# Altium schematic sheet Ethernet.SchDoc: {Наименование}
size 420 x 297 mm; DocumentNumber: ПЛАС.ХХХХХХ.ХХХ ХХ; SheetNumber: 4; SheetTotal: 11; PageSetup: Record=PageOptions|CenterHorizontal=False|CenterVertical=False|PrintScale=0.95|XCorrection=0.00|YCorrection=0.00|PrintKind=1|BorderSize=5000000|LeftOffset=0|BottomOffset=0|Orientation=1|PaperLength=1000|PaperWidth=1000|Scale=100|PaperSource=15|PrintQuality=600|MediaType=1|DitherType=10|PaperKind=A4|PrintScaleMode=1; Rule: PcbType=ProtelPcb
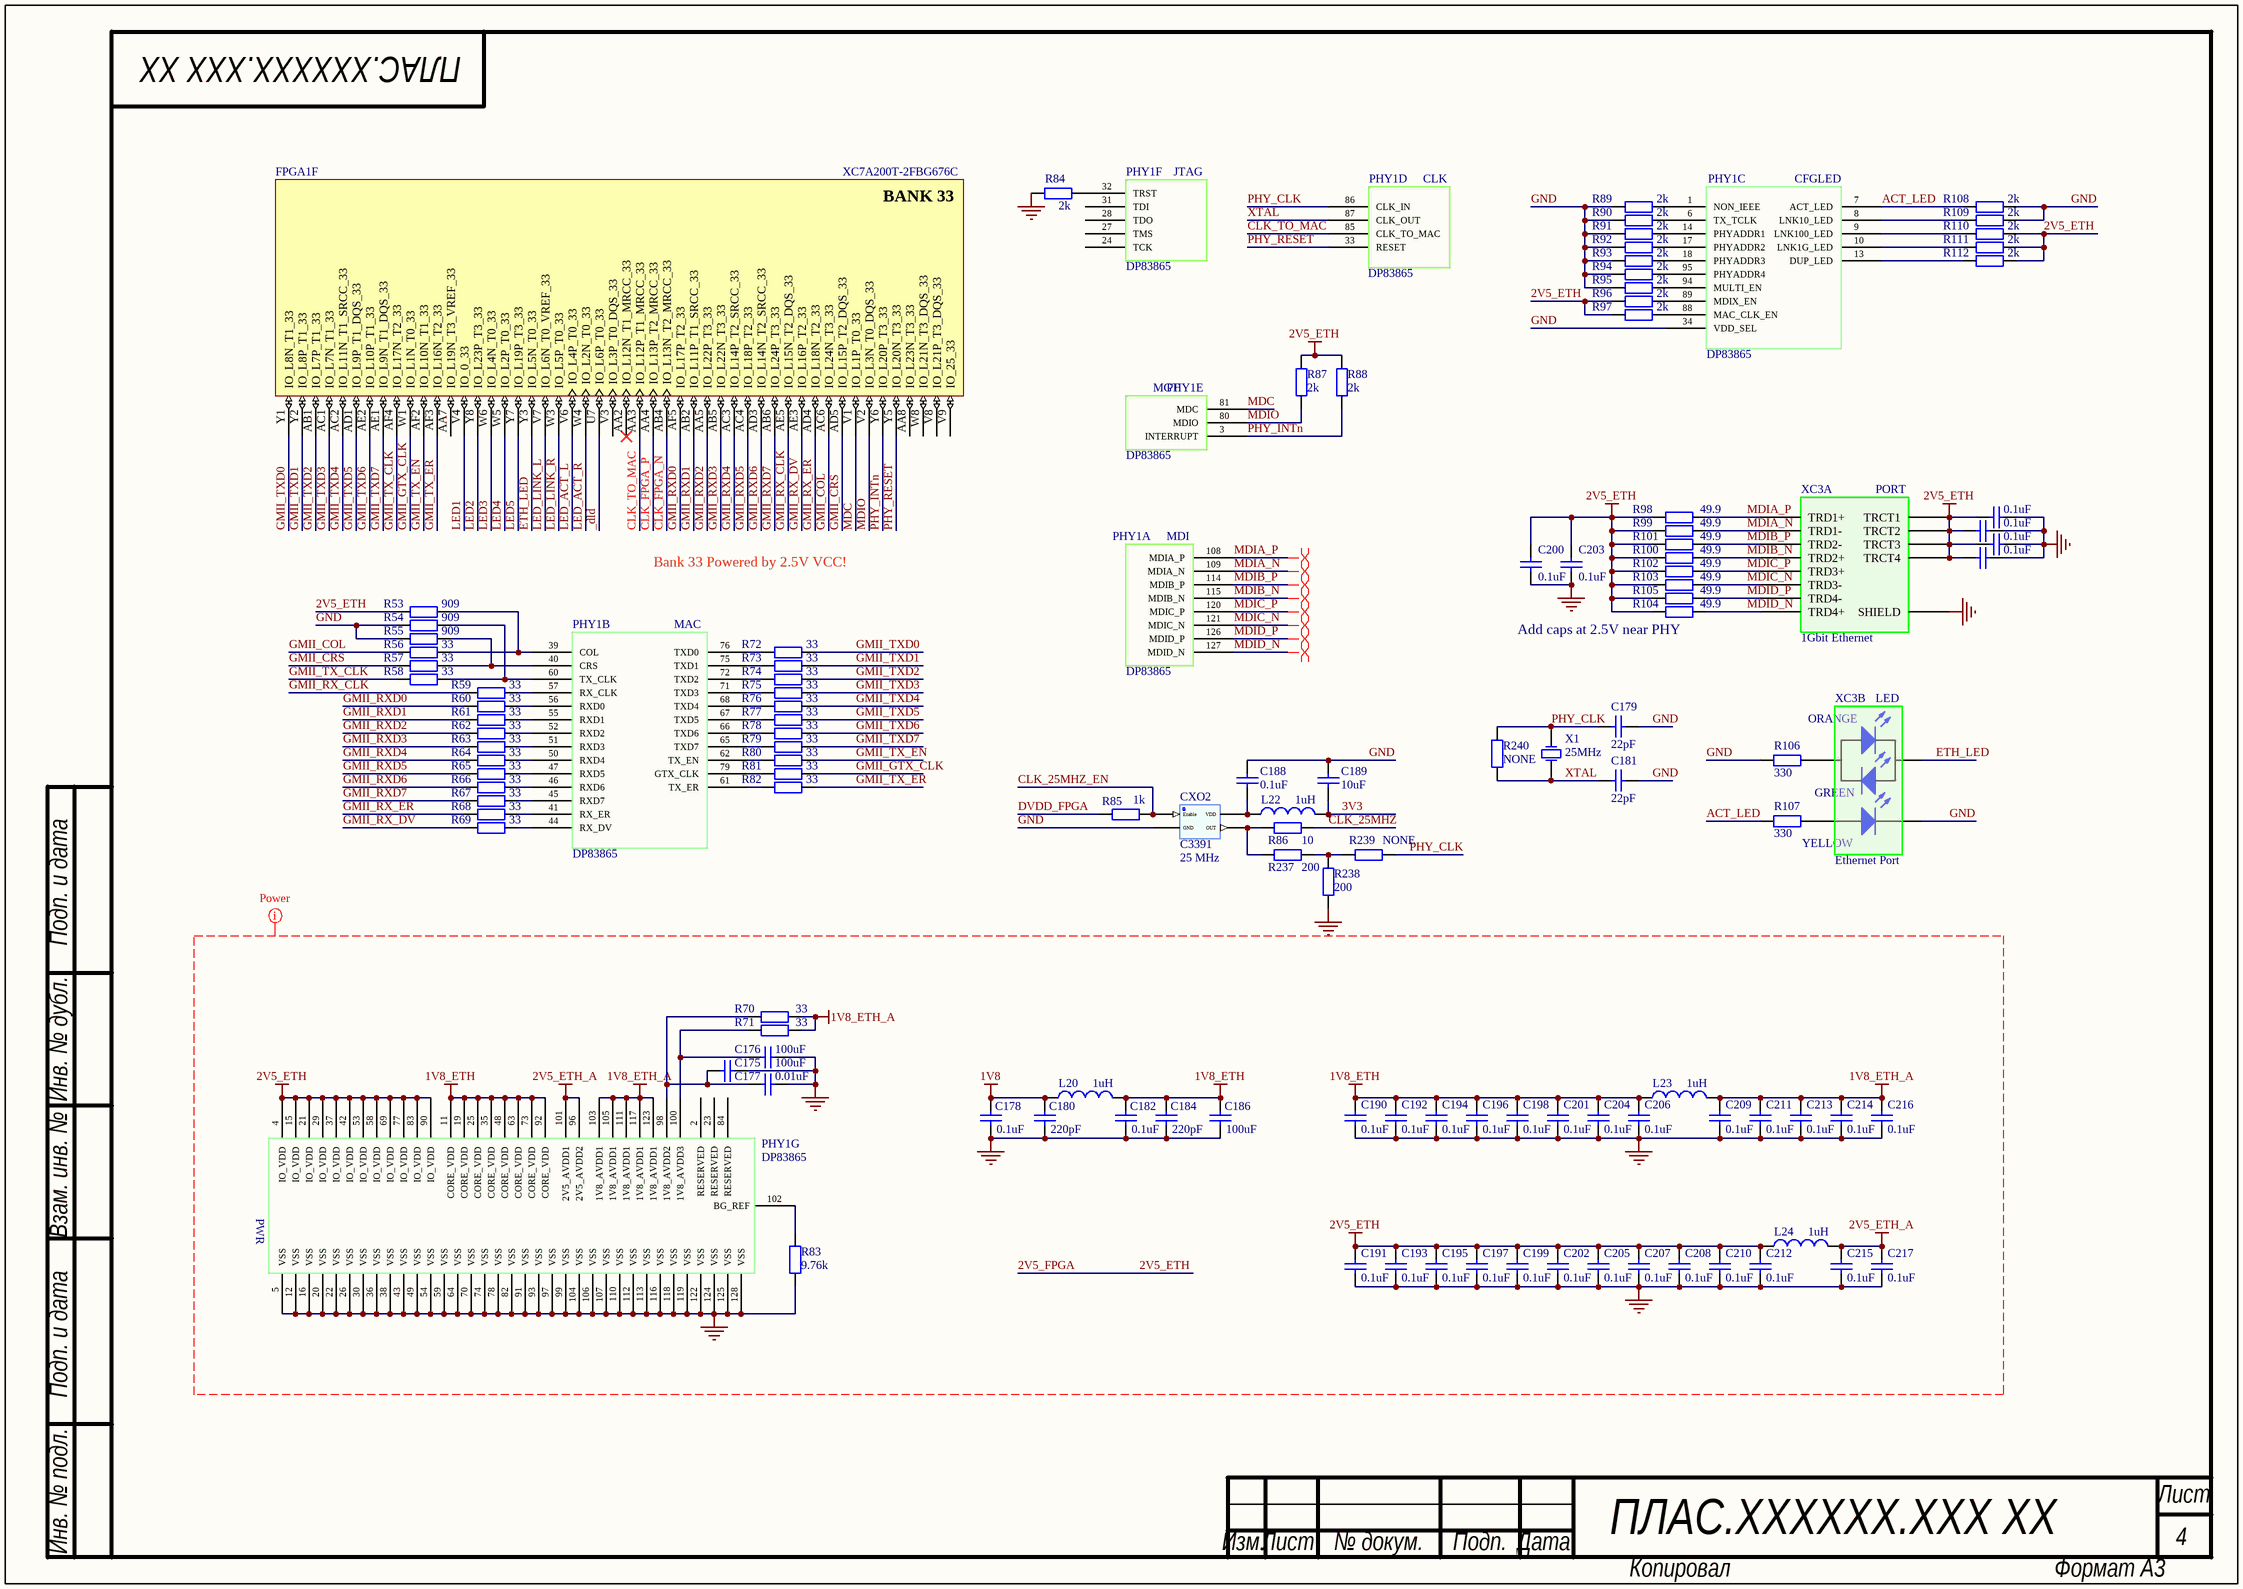
[diagram p0: Ethernet.SchDoc]

## Parts
C175  value 100uF  [C1210]  (hidden comment: Cap)
C176  value 100uF  [C1210]  (hidden comment: Cap)
C177  value 0.01uF  [C0603]  (hidden comment: Cap)
C178  value 0.1uF  [C0603]  (hidden comment: Cap)
C179  value 22pF  [С0402]  (hidden comment: Cap)
C180  value 220pF  [C0603]  (hidden comment: Cap)
C181  value 22pF  [С0402]  (hidden comment: Cap)
C182  value 0.1uF  [C0603]  (hidden comment: Cap)
C184  value 220pF  [C0603]  (hidden comment: Cap)
C186  value 100uF  [C1210]  (hidden comment: Cap)
C188  value 0.1uF  [C0603]  (hidden comment: Cap)
C189  value 10uF  [C0603]  (hidden comment: Cap)
C190  value 0.1uF  [C0603]  (hidden comment: Cap)
C191  value 0.1uF  [C0603]  (hidden comment: Cap)
C192  value 0.1uF  [C0603]  (hidden comment: Cap)
C193  value 0.1uF  [C0603]  (hidden comment: Cap)
C194  value 0.1uF  [C0603]  (hidden comment: Cap)
C195  value 0.1uF  [C0603]  (hidden comment: Cap)
C196  value 0.1uF  [C0603]  (hidden comment: Cap)
C197  value 0.1uF  [C0603]  (hidden comment: Cap)
C198  value 0.1uF  [C0603]  (hidden comment: Cap)
C199  value 0.1uF  [C0603]  (hidden comment: Cap)
C200  value 0.1uF  [С0402]  (hidden comment: Cap)
C201  value 0.1uF  [C0603]  (hidden comment: Cap)
C202  value 0.1uF  [C0603]  (hidden comment: Cap)
C203  value 0.1uF  [С0402]  (hidden comment: Cap)
C204  value 0.1uF  [C0603]  (hidden comment: Cap)
C205  value 0.1uF  [C0603]  (hidden comment: Cap)
C206  value 0.1uF  [C0603]  (hidden comment: Cap)
C207  value 0.1uF  [C0603]  (hidden comment: Cap)
C208  value 0.1uF  [C0603]  (hidden comment: Cap)
C209  value 0.1uF  [C0603]  (hidden comment: Cap)
C210  value 0.1uF  [C0603]  (hidden comment: Cap)
C211  value 0.1uF  [C0603]  (hidden comment: Cap)
C212  value 0.1uF  [C0603]  (hidden comment: Cap)
C213  value 0.1uF  [C0603]  (hidden comment: Cap)
C214  value 0.1uF  [C0603]  (hidden comment: Cap)
C215  value 0.1uF  [C0603]  (hidden comment: Cap)
C216  value 0.1uF  [C0603]  (hidden comment: Cap)
C217  value 0.1uF  [C0603]  (hidden comment: Cap)
C218  value 0.1uF  [С0402]  (hidden comment: Cap)
C219  value 0.1uF  [С0402]  (hidden comment: Cap)
C220  value 0.1uF  [С0402]  (hidden comment: Cap)
C221  value 0.1uF  [С0402]  (hidden comment: Cap)
CXO2  C3391  Frequency: 25 MHz  [CTS_CB3]
FPGA1  XC7A200T-2FBG676C  [FGG676]  (part F of 14)
L20  value 1uH  [L1210_Murata LQH]  (hidden comment: Inductor_LF)
L22  value 1uH  [L1206_Murata]  (hidden comment: Inductor_LF)
L23  value 1uH  [L1210_Murata LQH]  (hidden comment: Inductor_LF)
L24  value 1uH  [L1210_Murata LQH]  (hidden comment: Inductor_LF)
PHY1  DP83865  [LQFP-128]  (parts A,B,C,D,E,F,G of 7)
R53  value 909  [R0402]  (hidden comment: Res)
R54  value 909  [R0402]  (hidden comment: Res)
R55  value 909  [R0402]  (hidden comment: Res)
R56  value 33  [R0402]  (hidden comment: Res)
R57  value 33  [R0402]  (hidden comment: Res)
R58  value 33  [R0402]  (hidden comment: Res)
R59  value 33  [R0402]  (hidden comment: Res)
R60  value 33  [R0402]  (hidden comment: Res)
R61  value 33  [R0402]  (hidden comment: Res)
R62  value 33  [R0402]  (hidden comment: Res)
R63  value 33  [R0402]  (hidden comment: Res)
R64  value 33  [R0402]  (hidden comment: Res)
R65  value 33  [R0402]  (hidden comment: Res)
R66  value 33  [R0402]  (hidden comment: Res)
R67  value 33  [R0402]  (hidden comment: Res)
R68  value 33  [R0402]  (hidden comment: Res)
R69  value 33  [R0402]  (hidden comment: Res)
R70  value 33  [R0402]  (hidden comment: Res)
R71  value 33  [R0402]  (hidden comment: Res)
R72  value 33  [R0402]  (hidden comment: Res)
R73  value 33  [R0402]  (hidden comment: Res)
R74  value 33  [R0402]  (hidden comment: Res)
R75  value 33  [R0402]  (hidden comment: Res)
R76  value 33  [R0402]  (hidden comment: Res)
R77  value 33  [R0402]  (hidden comment: Res)
R78  value 33  [R0402]  (hidden comment: Res)
R79  value 33  [R0402]  (hidden comment: Res)
R80  value 33  [R0402]  (hidden comment: Res)
R81  value 33  [R0402]  (hidden comment: Res)
R82  value 33  [R0402]  (hidden comment: Res)
R83  value 9.76k  [R0402]  (hidden comment: Res)
R84  value 2k  [R0402]  (hidden comment: Res)
R85  value 1k  [R0402]  (hidden comment: Res)
R86  value 10  [R0402]  (hidden comment: Res)
R87  value 2k  [R0402]  (hidden comment: Res)
R88  value 2k  [R0402]  (hidden comment: Res)
R89  value 2k  [R0402]  (hidden comment: Res)
R90  value 2k  [R0402]  (hidden comment: Res)
R91  value 2k  [R0402]  (hidden comment: Res)
R92  value 2k  [R0402]  (hidden comment: Res)
R93  value 2k  [R0402]  (hidden comment: Res)
R94  value 2k  [R0402]  (hidden comment: Res)
R95  value 2k  [R0402]  (hidden comment: Res)
R96  value 2k  [R0402]  (hidden comment: Res)
R97  value 2k  [R0402]  (hidden comment: Res)
R98  value 49.9  [R0402]  (hidden comment: Res)
R99  value 49.9  [R0402]  (hidden comment: Res)
R100  value 49.9  [R0402]  (hidden comment: Res)
R101  value 49.9  [R0402]  (hidden comment: Res)
R102  value 49.9  [R0402]  (hidden comment: Res)
R103  value 49.9  [R0402]  (hidden comment: Res)
R104  value 49.9  [R0402]  (hidden comment: Res)
R105  value 49.9  [R0402]  (hidden comment: Res)
R106  value 330  [R0402]  (hidden comment: Res)
R107  value 330  [R0402]  (hidden comment: Res)
R108  value 2k  [R0402]  (hidden comment: Res)
R109  value 2k  [R0402]  (hidden comment: Res)
R110  value 2k  [R0402]  (hidden comment: Res)
R111  value 2k  [R0402]  (hidden comment: Res)
R112  value 2k  [R0402]  (hidden comment: Res)
R237  value 200  [R0402]  (hidden comment: Res)
R238  value 200  [R0402]  (hidden comment: Res)
R239  value NONE  [R0402]  (hidden comment: Res)
R240  value NONE  [R0402]  (hidden comment: Res)
X1  25MHz  [XTAL]
XC3  1Gbit Ethernet  [0826-1X1T-23-F]  (parts A,B of 2)

## Nets
1V8: C178.1 C180.1 L20.2
1V8_ETH: C182.1 C184.1 C186.1 C190.2 C192.1 C194.1 C196.2 C198.1 C201.1 C204.1 C206.1 L20.1 L23.1 PHY1.11(CORE_VDD) PHY1.19(CORE_VDD) PHY1.25(CORE_VDD) PHY1.35(CORE_VDD) PHY1.48(CORE_VDD) PHY1.63(CORE_VDD) PHY1.73(CORE_VDD) PHY1.92(CORE_VDD)
1V8_ETH_A: C209.1 C211.1 C213.1 C214.1 C216.1 L23.2 PHY1.103(1V8_AVDD1) PHY1.105(1V8_AVDD1) PHY1.111(1V8_AVDD1) PHY1.117(1V8_AVDD1) PHY1.123(1V8_AVDD1) R70.1 R71.1
2V5_ETH: C191.1 C193.1 C195.1 C197.1 C199.2 C200.1 C202.2 C203.1 C205.1 C207.1 C208.1 C210.1 C212.1 C218.1 C219.1 C220.1 C221.1 L24.1 PHY1.4(IO_VDD) PHY1.15(IO_VDD) PHY1.21(IO_VDD) PHY1.29(IO_VDD) PHY1.37(IO_VDD) PHY1.42(IO_VDD) PHY1.53(IO_VDD) PHY1.58(IO_VDD) PHY1.69(IO_VDD) PHY1.77(IO_VDD) PHY1.83(IO_VDD) PHY1.90(IO_VDD) R53.1 R87.1 R88.1 R96.1 R97.1 R98.1 R99.1 R100.1 R101.1 R102.1 R103.1 R104.1 R105.1 R110.2 R111.2 R112.2 XC3.1(TRCT3) XC3.6(TRCT2) XC3.7(TRCT4) XC3.12(TRCT1)  [also labelled 2V5_FPGA]
2V5_ETH_A: C215.1 C217.1 L24.2 PHY1.96(2V5_AVDD2) PHY1.101(2V5_AVDD1)
GND: C175.1 C176.1 C177.1 C178.2 C179.2 C180.2 C181.2 C182.2 C184.2 C186.2 C188.2 C189.1 C190.1 C191.2 C192.2 C193.2 C194.2 C195.2 C196.1 C197.2 C198.2 C199.1 C200.2 C201.2 C202.1 C203.2 C204.2 C205.2 C206.2 C207.2 C208.2 C209.2 C210.2 C211.2 C212.2 C213.2 C214.2 C215.2 C216.2 C217.2 C218.2 C219.2 C220.2 C221.2 CXO2.2(GND) PHY1.5(VSS) PHY1.12(VSS) PHY1.16(VSS) PHY1.20(VSS) PHY1.22(VSS) PHY1.26(VSS) PHY1.30(VSS) PHY1.34(VDD_SEL) PHY1.36(VSS) PHY1.38(VSS) PHY1.43(VSS) PHY1.49(VSS) PHY1.54(VSS) PHY1.59(VSS) PHY1.64(VSS) PHY1.70(VSS) PHY1.74(VSS) PHY1.78(VSS) PHY1.82(VSS) PHY1.91(VSS) PHY1.93(VSS) PHY1.97(VSS) PHY1.99(VSS) PHY1.104(VSS) PHY1.106(VSS) PHY1.107(VSS) PHY1.110(VSS) PHY1.112(VSS) PHY1.113(VSS) PHY1.116(VSS) PHY1.118(VSS) PHY1.119(VSS) PHY1.122(VSS) PHY1.124(VSS) PHY1.125(VSS) PHY1.128(VSS) R54.1 R55.2 R83.2 R84.2 R89.2 R90.2 R91.1 R92.2 R93.1 R94.1 R95.1 R106.2 R108.1 R109.1 R238.2 XC3.0(SHIELD) XC3.13(LED1)
3V3: C189.2 L22.1
_dld: FPGA1.U7(IO_L6P_T0_33)
ACT_LED: PHY1.7(ACT_LED) R107.1 R108.2
CLK_25MHZ: R86.1
CLK_25MHZ_EN: CXO2.1(Enable) R85.1
CLK_FPGA_N: FPGA1.AB4(IO_L13N_T2_MRCC_33)
CLK_FPGA_P: FPGA1.AA4(IO_L13P_T2_MRCC_33)
CLK_TO_MAC: FPGA1.AA3(IO_L12P_T1_MRCC_33) PHY1.85(CLK_TO_MAC)
DVDD_FPGA: R85.2
ETH_LED: FPGA1.Y3(IO_L5N_T0_33) XC3.16(LED2)
GMII_COL: FPGA1.AC6(IO_L24N_T3_33) R56.1
GMII_CRS: FPGA1.AD5(IO_L15P_T2_DQS_33) R57.1
GMII_GTX_CLK: FPGA1.W1(IO_L1N_T0_33) R81.2
GMII_RX_CLK: FPGA1.AE5(IO_L15N_T2_DQS_33) R59.2
GMII_RX_DV: FPGA1.AE3(IO_L16P_T2_33) R69.2
GMII_RX_ER: FPGA1.AD4(IO_L18N_T2_33) R68.2
GMII_RXD0: FPGA1.AF5(IO_L17P_T2_33) R60.2
GMII_RXD1: FPGA1.AB2(IO_L11P_T1_SRCC_33) R61.2
GMII_RXD2: FPGA1.AA5(IO_L22P_T3_33) R62.2
GMII_RXD3: FPGA1.AB5(IO_L22N_T3_33) R63.2
GMII_RXD4: FPGA1.AC3(IO_L14P_T2_SRCC_33) R64.2
GMII_RXD5: FPGA1.AC4(IO_L18P_T2_33) R65.2
GMII_RXD6: FPGA1.AD3(IO_L14N_T2_SRCC_33) R66.2
GMII_RXD7: FPGA1.AB6(IO_L24P_T3_33) R67.2
GMII_TX_CLK: FPGA1.AF4(IO_L17N_T2_33) R58.1
GMII_TX_EN: FPGA1.AF2(IO_L10N_T1_33) R80.2
GMII_TX_ER: FPGA1.AF3(IO_L16N_T2_33) R82.2
GMII_TXD0: FPGA1.Y1(IO_L8N_T1_33) R72.2
GMII_TXD1: FPGA1.Y2(IO_L8P_T1_33) R73.2
GMII_TXD2: FPGA1.AB1(IO_L7P_T1_33) R74.2
GMII_TXD3: FPGA1.AC1(IO_L7N_T1_33) R75.2
GMII_TXD4: FPGA1.AC2(IO_L11N_T1_SRCC_33) R76.2
GMII_TXD5: FPGA1.AD1(IO_L9P_T1_DQS_33) R77.2
GMII_TXD6: FPGA1.AE2(IO_L10P_T1_33) R78.2
GMII_TXD7: FPGA1.AE1(IO_L9N_T1_DQS_33) R79.2
LED1: FPGA1.V4(IO_0_33)
LED2: FPGA1.Y8(IO_L23P_T3_33)
LED3: FPGA1.W6(IO_L4N_T0_33)
LED4: FPGA1.W5(IO_L2P_T0_33)
LED5: FPGA1.Y7(IO_L19P_T3_33)
LED_ACT_L: FPGA1.V6(IO_L4P_T0_33)
LED_ACT_R: FPGA1.W4(IO_L2N_T0_33)
LED_LINK_L: FPGA1.V7(IO_L6N_T0_VREF_33)
LED_LINK_R: FPGA1.W3(IO_L5P_T0_33)
MDC: FPGA1.V1(IO_L1P_T0_33) PHY1.81(MDC)
MDIA_N: PHY1.109(MDIA_N) R99.2 XC3.10(TRD1-)
MDIA_P: PHY1.108(MDIA_P) R98.2 XC3.11(TRD1+)
MDIB_N: PHY1.115(MDIB_N) R100.2 XC3.4(TRD2+)
MDIB_P: PHY1.114(MDIB_P) R101.2 XC3.5(TRD2-)
MDIC_N: PHY1.121(MDIC_N) R103.2 XC3.2(TRD3-)
MDIC_P: PHY1.120(MDIC_P) R102.2 XC3.3(TRD3+)
MDID_N: PHY1.127(MDID_N) R104.2 XC3.8(TRD4+)
MDID_P: PHY1.126(MDID_P) R105.2 XC3.9(TRD4-)
MDIO: FPGA1.V2(IO_L3N_T0_DQS_33) PHY1.80(MDIO) R87.2
PHY_CLK: C179.1 PHY1.86(CLK_IN) R239.1 R240.1 X1.3(OSC2)
PHY_INTn: FPGA1.Y6(IO_L20P_T3_33) PHY1.3(INTERRUPT) R88.2
PHY_RESET: FPGA1.Y5(IO_L20N_T3_33) PHY1.33(RESET)
XTAL: C181.1 PHY1.87(CLK_OUT) R240.2 X1.1(OSC1)
NetC175_2: C175.2 C177.2 PHY1.98(1V8_AVDD2) R70.2
NetC176_2: C176.2 PHY1.100(1V8_AVDD3) R71.2
NetC188_1: C188.1 CXO2.4(VDD) L22.2
NetCXO2_3: CXO2.3(OUT) R86.2 R237.1
NetPHY1_1: PHY1.1(NON_IEEE) R89.1
NetPHY1_6: PHY1.6(TX_TCLK) R90.1
NetPHY1_8: PHY1.8(LNK10_LED) R109.2
NetPHY1_9: PHY1.9(LNK100_LED) R110.1
NetPHY1_10: PHY1.10(LNK1G_LED) R111.1
NetPHY1_13: PHY1.13(DUP_LED) R112.1
NetPHY1_14: PHY1.14(PHYADDR1) R91.2
NetPHY1_17: PHY1.17(PHYADDR2) R92.1
NetPHY1_18: PHY1.18(PHYADDR3) R93.2
NetPHY1_32: PHY1.32(TRST) R84.1
NetPHY1_39: PHY1.39(COL) R53.2 R56.2
NetPHY1_40: PHY1.40(CRS) R55.1 R57.2
NetPHY1_41: PHY1.41(RX_ER) R68.1
NetPHY1_44: PHY1.44(RX_DV) R69.1
NetPHY1_45: PHY1.45(RXD7) R67.1
NetPHY1_46: PHY1.46(RXD6) R66.1
NetPHY1_47: PHY1.47(RXD5) R65.1
NetPHY1_50: PHY1.50(RXD4) R64.1
NetPHY1_51: PHY1.51(RXD3) R63.1
NetPHY1_52: PHY1.52(RXD2) R62.1
NetPHY1_55: PHY1.55(RXD1) R61.1
NetPHY1_56: PHY1.56(RXD0) R60.1
NetPHY1_57: PHY1.57(RX_CLK) R59.1
NetPHY1_60: PHY1.60(TX_CLK) R54.2 R58.2
NetPHY1_61: PHY1.61(TX_ER) R82.1
NetPHY1_62: PHY1.62(TX_EN) R80.1
NetPHY1_65: PHY1.65(TXD7) R79.1
NetPHY1_66: PHY1.66(TXD6) R78.1
NetPHY1_67: PHY1.67(TXD5) R77.1
NetPHY1_68: PHY1.68(TXD4) R76.1
NetPHY1_71: PHY1.71(TXD3) R75.1
NetPHY1_72: PHY1.72(TXD2) R74.1
NetPHY1_75: PHY1.75(TXD1) R73.1
NetPHY1_76: PHY1.76(TXD0) R72.1
NetPHY1_79: PHY1.79(GTX_CLK) R81.1
NetPHY1_88: PHY1.88(MAC_CLK_EN) R97.2
NetPHY1_89: PHY1.89(MDIX_EN) R96.2
NetPHY1_94: PHY1.94(MULTI_EN) R95.2
NetPHY1_95: PHY1.95(PHYADDR4) R94.2
NetPHY1_102: PHY1.102(BG_REF) R83.1
NetR106_1: R106.1 XC3.15
NetR107_2: R107.2 XC3.14
NetR237_2: R237.2 R238.1 R239.2

Not connected (* = marked no-connect by the designer): FPGA1 AA2(IO_L12N_T1_MRCC_33)* AA7(IO_L19N_T3_VREF_33) AA8(IO_L23N_T3_33) V3(IO_L3P_T0_DQS_33) V8(IO_L21P_T3_DQS_33) V9(IO_25_33) W8(IO_L21N_T3_DQS_33); PHY1 2(RESERVED) 23(RESERVED) 24(TCK) 27(TMS) 28(TDO) 31(TDI) 84(RESERVED)

## Layout directives
differential pair: MDIA_N, MDIA_P, MDIB_N, MDIB_P, MDIC_N, MDIC_P, MDID_N, MDID_P
net class Power: 1V8, 1V8_ETH, 1V8_ETH_A, 2V5_ETH, 2V5_ETH_A, 2V5_FPGA, GND

## Notes on the sheet
- Bank 33 Powered by 2.5V VCC!
- (near R104) Add caps at 2.5V near PHY
- Подп. и дата
- Инв. № дубл.
- Взам. инв. №
- Инв. № подл.
- Лист
- Изм.
- № докум.
- Подп.
- Дата
- Копировал
- Формат А3
- (in symbol 0826-1X1T-23-F, part A) PORT
- (in symbol 0826-1X1T-23-F, part B) LED; ORANGE; GREEN; YELLOW
- (in symbol DP83865, part A) MDI
- (in symbol DP83865, part B) MAC
- (in symbol DP83865, part C) CFGLED
- (in symbol DP83865, part D) CLK
- (in symbol DP83865, part E) MGT
- (in symbol DP83865, part F) JTAG
- (in symbol DP83865, part G) PWR
- (in symbol XC7A200T-2FBG676C, part F) BANK 33

## Library data of the parts
C175 C176 C186 = Cap uF: Cer Cap Large; Manufacturer: Murata; Material: x5r; Tolerance: 20%; Voltage: 6.3V; Type: Ceramic; Package: C1210; PackageDescription: SMD Chip Capacitor
C177 = Cer Cap: Cer Cap Small; Manufacturer: Murata; Material: x5r; Voltage: 50V; Tolerance: 10%; Type: Ceramic; PackageReference: SMD Chip Capacitor; Package: 0603
C178 C180 C182 C184 C188 C190-C199 C201 C202 C204-C217 = Cer Cap: Cer Cap Small; Manufacturer: Murata; Material: x5r; Voltage: 16V; Tolerance: 10%; Type: Ceramic; PackageReference: SMD Chip Capacitor; Package: 0603
C179 C181 = Cer Cap: Cer Cap Small; Manufacturer: Murata; Material: NP0; Voltage: 50V; Tolerance: 10%; Type: Ceramic; PackageReference: SMD Chip Capacitor; Package: 0402
C189 = Cer Cap: Cer Cap Small; Manufacturer: Murata; Material: x7r; Voltage: 6.3V; Tolerance: 10%; Type: Ceramic; PackageReference: SMD Chip Capacitor; Package: 0603
C200 C203 = Cer Cap: Cer Cap Small; Manufacturer: Murata; Material: x7r; Voltage: 16V; Tolerance: 10%; Type: Ceramic; PackageReference: SMD Chip Capacitor; Package: 0402
C218-C221 = Cer Cap: Cer Cap Small; Manufacturer: Murata; Material: x7r; Voltage: 50V; Tolerance: 10%; Type: Ceramic; PackageReference: SMD Chip Capacitor; Package: 0402
CXO2 = 5x7 CXO: Crystal Oscillator; Manufacturer: Crystek; Name: C3391-25.000; Voltage: 3.3V ±0.3V; Output Current: ±24mA Max; Input Current: 15mA Typical; Stability: ± 25ppm; Package: 5×7 mm SMD; Temperature Range: 0°C to +70°C; Type: 3.3V, HCMOS
FPGA1 = XC7A200T-2FBG676C: Artix-7 FPGA, 400 User I/Os, 8 GTP, 676-Ball BGA, Speed Grade 2, Commercial Grade, Pb-Free; Manufacturer: Xilinx; Block RAM Blocks (18Kb): 730; Block RAM Blocks (36Kb): 365; Block RAM Blocks (Max Kb): 13140; CLBs (Slices): 33650; Clock Mgmt Tiles (CMTs): 10; DSP48E1 Slices: 740; Logic Cells: 215360; Max User I/O: 500; Speed Grade: -2; DatasheetVersion: v1.12; PackageVersion: Rev 1.8; PackageReference: FBG676; PackageDescription: Flip-Chip Lidless BGA, Body 27 x 27 mm, 1.0 mm Pitch; Supplier 1: Digi-Key; Supplier Part Number 1: 122-1865-ND; CLBs (Max Distributed RAM Kb): 2888; Generic Part Number: XC7A200T; RoHS: Pb-Free; NexusDeviceID: XC7A200T-2FBG676C; Mounting Technology: Surface Mount; Code_JEDEC: MS-034; PartNumber: XC7A200T-2FBG676C; ComponentLink1Description: Manufacturer URL; ComponentLink1URL: http://www.xilinx.com/; ComponentLink2Description: Datasheet; ComponentLink2URL: http://www.xilinx.com/support/documentation/data_sheets/ds180_7Series_Overview.pdf; ComponentLink3Description: Package Specification; ComponentLink3URL: http://www.xilinx.com/support/documentation/user_guides/ug475_7Series_Pkg_Pinout.pdf; ComponentLink4Description: DC and Switching Characteristics; ComponentLink4URL: http://www.xilinx.com/support/documentation/data_sheets/ds181_Artix_7_Data_Sheet.pdf; ComponentLink5Description: Package File; ComponentLink5URL: http://www.xilinx.com/support/packagefiles/a7packages/xc7a200tfbg676pkg.txt; ComponentLink6Description: Packaging and Pinout; ComponentLink6URL: http://www.xilinx.com/support/documentation/user_guides/ug475_7Series_Pkg_Pinout.pdf
L20 L23 L24 = Inductor_LF: Inductor_Power_Lines; Manufacturer: Murata; Name: LQH32PN1R0NNC; Tolerance: 5%; Current: 2500mA; Frequency: 100MHz; Package: 1210; PackageDescription: Chip Inductor; Temperature Range: -25…85; Series: LQH
L22 = Inductor_LF: Inductor_Power_Lines; Manufacturer: Murata; Name: LQM31PN1R0M00; Tolerance: 5%; Current: 1200mA; Frequency: 60MHz; Package: 1206; PackageDescription: Chip Inductor; Temperature Range: -25…85; Series: LQM
PHY1 = DP83865: 10/100/1000 Ethernet Physical Layer; Name: DP83865DVH; Type: 10/100/1000 Ethernet Physical Layer; Package: LQFP-128
R53-R112 R237-R240 = Res: Resistor; Name: Chip SMD Resistor; Tolerance: 5%; Power: 0.062 Wt; Package: SMD; Temperature Range: -55…155
X1 = XTAL: Manufacturer: GEYER ELECTRONIC; Name: KX-13T; Frequancy: 25.000MHz; Ttolerance: ± 30 ppm
XC3 = 0826-1X1T-23-F: Gigabit Single Port; Name: 0826-1X1T-23-F; Type: Gigabit Ethernet Single Port with LEDs